# Altium schematic sheet Preamplifier.SchDoc
size A4
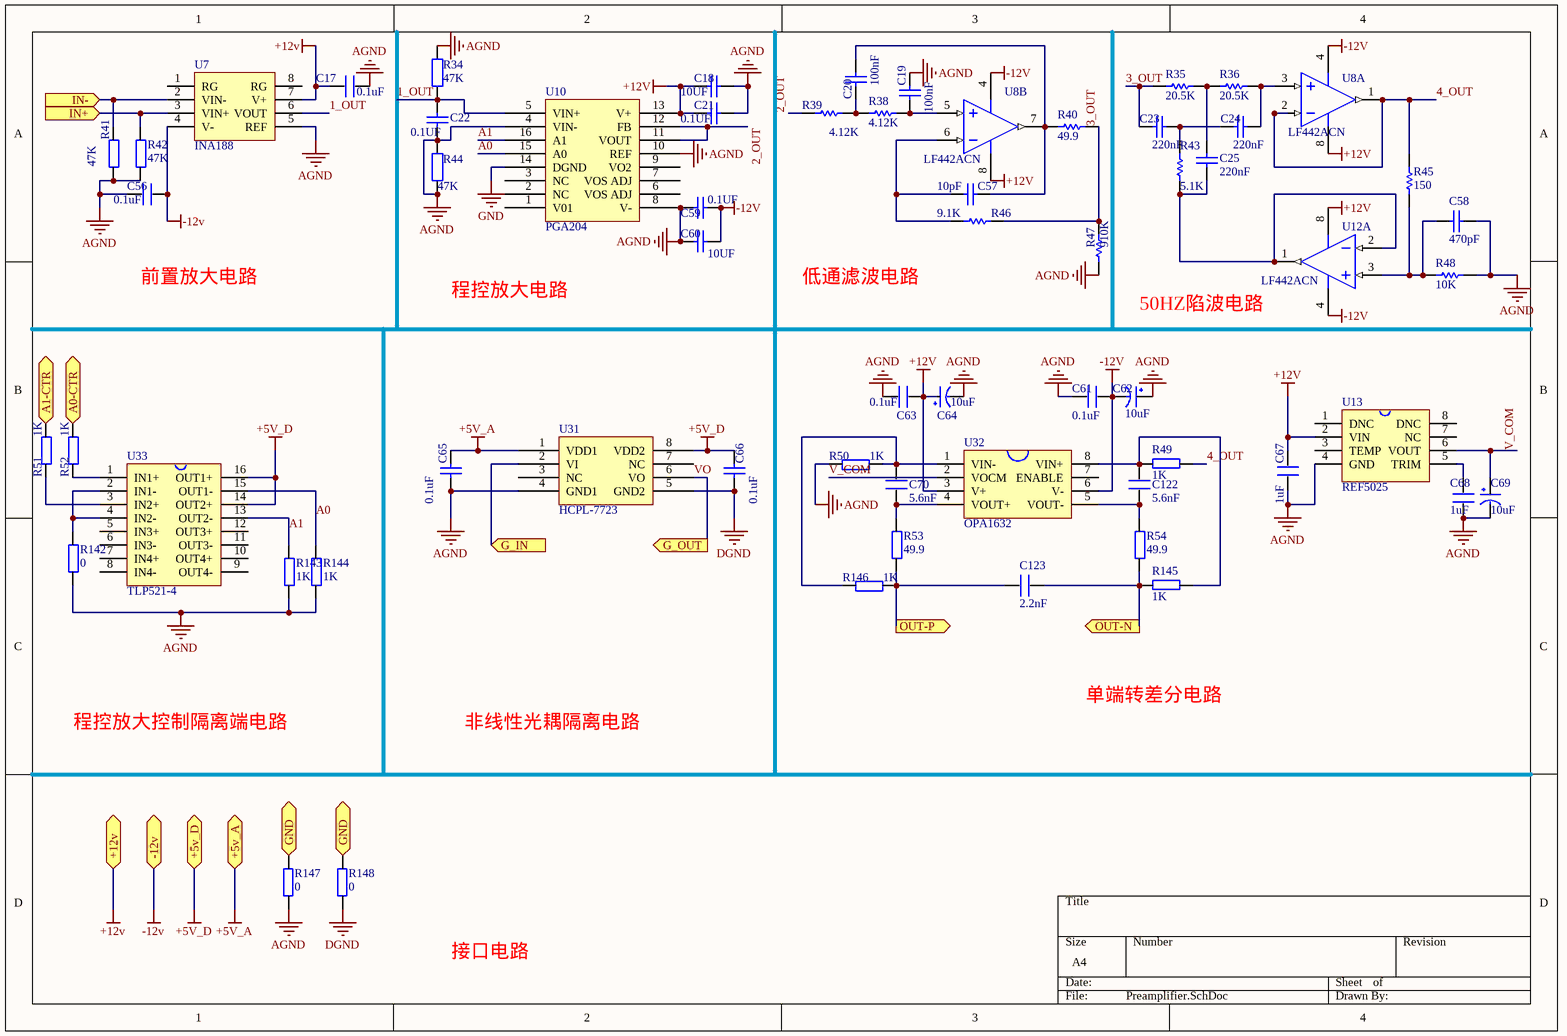
[diagram p0: Preamplifier.SchDoc]

## Parts
C17  0.1uF  [0603P]
C18  10UF  [0805]
C19  100nF  [C0805]
C20  100nF  [C0805]
C21  0.1UF  [0805]
C22  0.1UF  [0805]
C23  220nF  [C0805]
C24  220nF  [C0805]
C25  220nF  [C0805]
C56  0.1uF  [0603P]
C57  10pF  [C0805]
C58  470pF  [C0805]
C59  0.1UF  [0805]
C60  10UF  [0805]
C61  0.1uF  [0603P]
C62  10uF  [CC6.56.5]
C63  0.1uF  [0603P]
C64  10uF  [CC6.56.5]
C65  value 0.1uF  [RAD-0.3]  (hidden comment: Cap)
C66  value 0.1uF  [RAD-0.3]  (hidden comment: Cap)
C67  1uF  [0603P]
C68  1uF  [0603P]
C69  10uF  [CC6.56.5]
C70  5.6nF  [0603P]
C122  5.6nF  [0603P]
C123  2.2nF  [0603P]
R34  47K  [0805]
R35  20.5K  [R0805]
R36  20.5K  [R0805]
R38  4.12K  [R0805]
R39  4.12K  [R0805]
R40  49.9  [R0805]
R41  47K  [0603P]
R42  47K  [0603P]
R43  5.1K  [R0805]
R44  47K  [0805]
R45  150  [R0805]
R46  9.1K  [R0805]
R47  910K  [R0805]
R48  10K  [R0805]
R49  1K  [0603P]
R50  1K  [0603P]
R51  1K  [0603P]
R52  1K  [0603P]
R53  49.9  [0603P]
R54  49.9  [0603P]
R142  0  [0603P]
R143  1K  [0603P]
R144  1K  [0603P]
R145  1K  [0603P]
R146  1K  [0603P]
R147  0  [0603P]
R148  0  [0603P]
U7  INA188  [SOIC-8]
U8  LF442ACN  [N08E]  (parts A,B of 2)
U10  PGA204
U12  LF442ACN  [N08E]  (part A of 2)
U13  REF5025  [R-PDSO-G8]
U31  HCPL-7723
U32  OPA1632  [S-PDSO-G8]
U33  TLP521-4  [11-20A3]

## Ports
+5v_A, +5v_D, +12v, -12v, A0-CTR (in), A1-CTR (in), G_IN (in), G_OUT (out), GND, IN+ (in), IN- (in), OUT-N (out), OUT-P (out)

## Nets
+5V_A: C65.2 U31.1(VDD1) ; port +5v_A
+5V_D: C66.2 U31.8(VDD2) U33.14(OUT2+) U33.16(OUT1+) ; port +5v_D
+12v: C17.1 C18.1 C21.1 C63.2 C64.1(VCC) C67.2 U7.7(V+) U8.8(V+) U10.13(V+) U12.8(V+) U13.2(VIN) U32.3(V+) ; port +12v
-12v: C56.2 C59.2 C60.2 C61.2 C62.2(GND) U7.4(V-) U8.4(V-) U12.4(V-) U32.6(V-) ; port -12v
AGND: C17.2 C18.2 C19.1 C21.2 C22.1 C56.1 C58.1 C59.1 C60.1 C61.1 C62.1(VCC) C63.1 C64.2(GND) C65.1 C67.1 C68.1 C69.2(GND) R34.2 R41.1 R42.1 R44.1 R44.2 R47.1 R48.1 R50.1 R142.1 R143.1 R144.1 R147.2 U7.5(REF) U10.4(VIN-) U10.8(V-) U10.10(REF) U13.4(GND) U31.4(GND1)
DGND: C66.1 R148.2 U31.5(GND2)
GND: U10.14(DGND)
1_OUT: C22.2 R34.1 U7.6(VOUT) U10.5(VIN+)
2_OUT: R39.1 U10.11(VOUT) U10.12(FB)
3_OUT: C23.1 R35.1 R40.2 R46.2 R47.2
4_OUT: R45.2 R49.1 U8.1(OUTA) U8.2(INA-)
A0: R144.2 U10.15(A0) U33.15(OUT1-)
A0-CTR: R52.2 ; port A0-CTR
A1: R143.2 U10.16(A1) U33.13(OUT2-)
A1-CTR: R51.2 ; port A1-CTR
G_IN: U31.2(VI) ; port G_IN
GND: R147.1 R148.1 ; port GND  [a separate net that carries the same name]
IN+: R42.2 U7.3(VIN+) ; port IN+
IN-: R41.2 U7.2(VIN-) ; port IN-
OUT-N: C123.2 R54.1 R145.2 ; port OUT-N
OUT-P: C123.1 R53.1 R146.2 ; port OUT-P
V_COM: C69.1(VCC) U13.6(VOUT) U32.2(VOCM)
VO: U31.6(VO) ; port G_OUT
NetC19_2: C19.2 R38.2 U8.5(INB+)
NetC20_1: C20.1 R38.1 R39.2
NetC20_2: C20.2 C57.2 R40.1 U8.7(OUTB)
NetC23_2: C23.2 C24.1 R43.2
NetC24_2: C24.2 R36.2 U8.3(INA+)
NetC25_1: C25.1 R43.1 U12.1(OUTA) U12.2(INA-)
NetC25_2: C25.2 R35.2 R36.1
NetC57_1: C57.1 R46.1 U8.6(INB-)
NetC58_2: C58.2 R45.1 R48.2 U12.3(INA+)
NetC68_2: C68.2 U13.5(TRIM)
NetC70_1: C70.1 R53.2 U32.4(VOUT+)
NetC70_2: C70.2 R50.2 R146.1 U32.1(VIN-)
NetC122_1: C122.1 R54.2 U32.5(VOUT-)
NetC122_2: C122.2 R49.2 R145.1 U32.8(VIN+)
NetR51_1: R51.1 U33.3(IN2+)
NetR52_1: R52.1 U33.1(IN1+)
NetR142_2: R142.2 U33.2(IN1-) U33.4(IN2-)

Not connected (* = marked no-connect by the designer): U7 1(RG) 8(RG); U10 1(V01) 2(NC) 3(NC) 6(VOS_ADJ) 7(VOS_ADJ) 9(VO2); U13 1(DNC) 3(TEMP) 7(NC) 8(DNC); U31 3(NC) 7(NC); U32 7(ENABLE); U33 5(IN3+) 6(IN3-) 7(IN4+) 8(IN4-) 9(OUT4-) 10(OUT4+) 11(OUT3-) 12(OUT3+)

## Notes on the sheet
- 前置放大电路
- 程控放大电路
- 低通滤波电路
- 50HZ陷波电路
- 单端转差分电路
- 程控放大控制隔离端电路
- 非线性光耦隔离电路
- 接口电路

## Library data of the parts
C17 C56 C61 C63 C67 C68 C70 C122 C123 = C
C18-C25 C57-C60 C65 C66 = Cap: Capacitor; Published: 8-Jun-2000; LatestRevisionDate: 17-Jul-2002; LatestRevisionNote: Re-released for DXP Platform.; PackageReference: RAD-0.3; Publisher: Altium Limited; PackageDescription: Radial Cap, Thru-Hole; 2 Leads; 0.3 in Pin Spacing
  C18 C60: Value: 10UF
  C19 C20: Value: 100nF
  C21 C22 C59: Value: 0.1UF
  C23-C25: Value: 220nF
  C57: Value: 10pF
  C58: Value: 470pF
C62 C64 C69 = CAP
R34 R44 = Res2: Resistor; Published: 8-Jun-2000; LatestRevisionDate: 17-Jul-2002; LatestRevisionNote: Re-released for DXP Platform.; PackageReference: AXIAL-0.4; Publisher: Altium Limited; PackageDescription: Axial Device, Thru-Hole; 2 Leads; 0.4 in Pin Spacing; Value: 47K
R35 R36 R38-R40 R43 R45-R48 = Res1: Resistor; Published: 8-Jun-2000; LatestRevisionDate: 17-Jul-2002; LatestRevisionNote: Re-released for DXP Platform.; PackageReference: AXIAL-0.3; Publisher: Altium Limited; PackageDescription: Axial Device, Thru-Hole; 2 Leads; 0.3 in Pin Spacing
  R35 R36: Value: 20.5K
  R38 R39: Value: 4.12K
  R40: Value: 49.9
  R43: Value: 5.1K
  R45: Value: 150
  R46: Value: 9.1K
  R47: Value: 910K
  R48: Value: 10K
R41 R42 R49-R54 R142-R148 = R
U8 U12 = LF442ACN: Dual Low Power JFET Input Operational Amplifier, 8-pin MDIP; Manufacturer: National Semiconductor; PackageTopMarking: NSUZXYTTE#*LF*442ACN; PowerWise: N; CompType: Amplifiers; Published: 4-Dec-2008; LatestRevisionDate: 13-Jan-2009; LatestRevisionNote: Sim Model Added.; DatasheetVersion: Aug-2000; PackageVersion: revG, May-2006; PackageReference: N08E; Publisher: Altium Limited; PackageDescription: MDIP, .365 x .250 x .130in, 8 Lead, .100in Pitch; Supplier 1: Farnell; Supplier Part Number 1: 4465726; PartNumber: LF442ACN; RoHS: N; PinCount: 8; Code_JEDEC: MS-001-BA; ComponentLink1Description: LF442 Datasheet; ComponentLink1URL: http://www.national.com/ds/LF/LF442.pdf; ComponentLink2Description: LF442 Web Page; ComponentLink2URL: http://www.national.com/pf/LF/LF442.html; ComponentLink3Description: N08E Package Page; ComponentLink3URL: http://www.national.com/packaging/folders/n08e.html
U10 = Component_1
U31 = HCPL
U33 = TLP521